# Altium project shield_can-display.PrjPcb
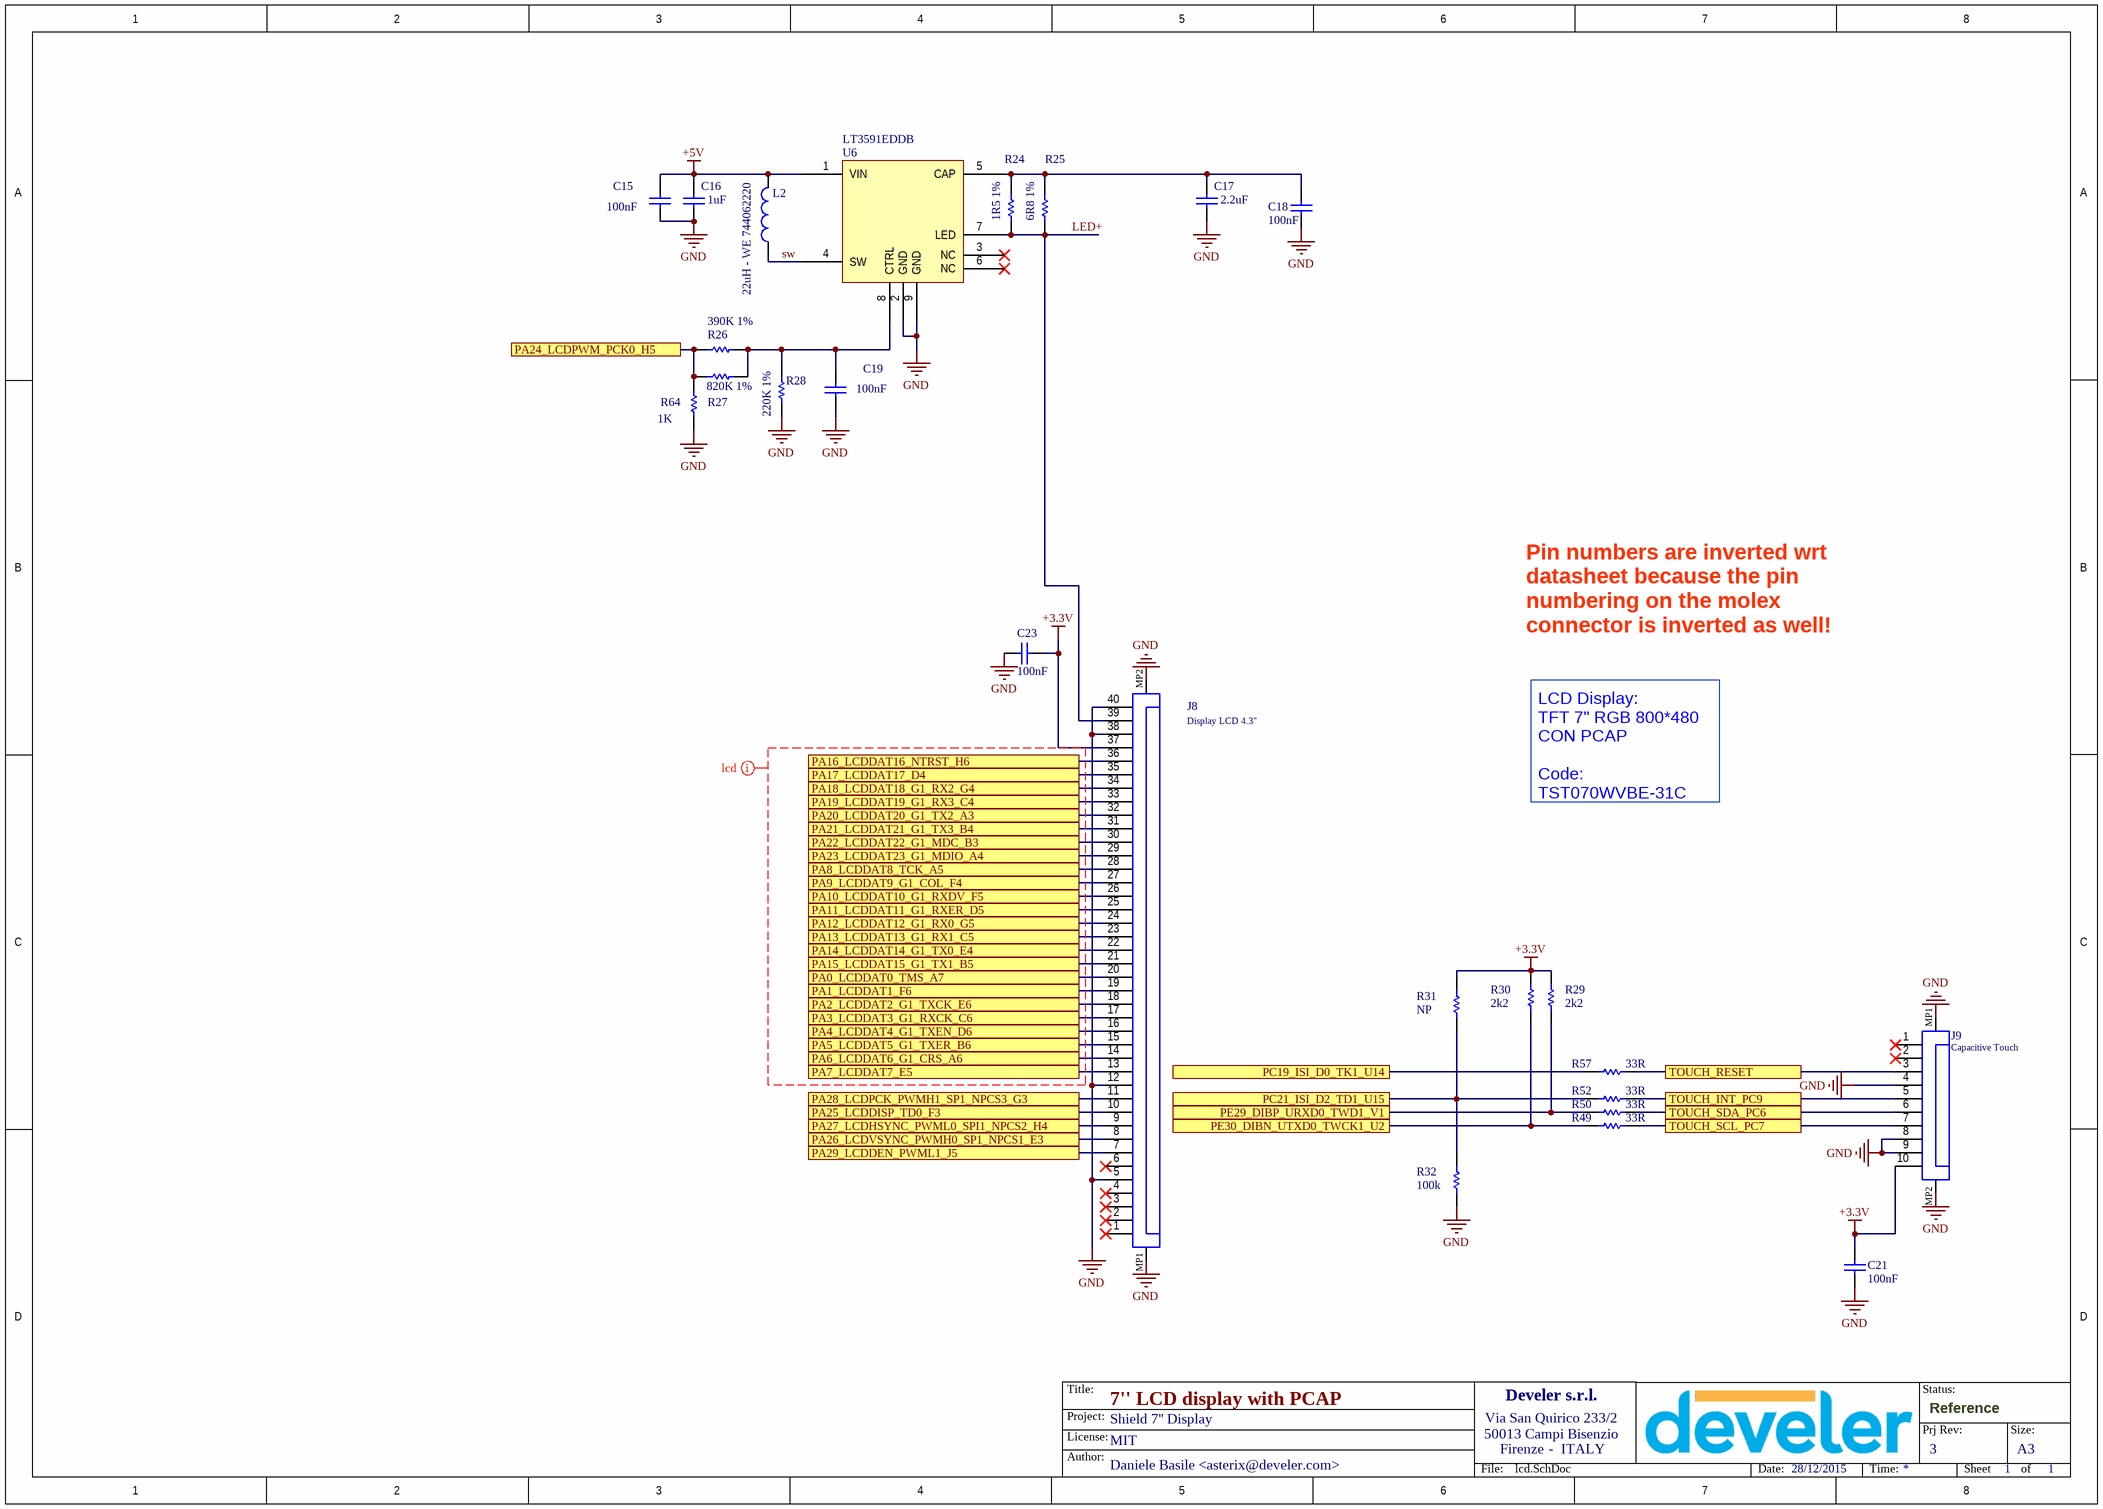
[diagram p0: lcd.SchDoc]
prj_status: Reference; prj_pn: -; prj_pcb: E; prj_name_long: Shield 7'' Display CAN, RS232, RS485; prj_name: Shield 7'' Display; prj_license: MIT; prj_hw_ver: 3; prj_date: 28/12/2015; pcb_stackup: Default; pcb_solder_color: WHITE; pcb_silkscreen_color: BLACK; pcb_material: FR4-Standard Tg 130-140C; pcb_layer_count: 2; pcb_finish: HASL
3 sheets, 96 parts. Net scope: flat (ports and power ports of the same name join across sheets).
Board file: shield_can-display.PcbDoc
Sheets:
  lcd.SchDoc
  eva01_connectors.SchDoc
  can.SchDoc

## Sheet lcd.SchDoc: 7'' LCD display with PCAP
size A3; Author: Daniele Basile <asterix@develer.com>; Organization: Develer s.r.l.; Address1: Via San Quirico 233/2; Address2: 50013 Campi Bisenzio; Address3: Firenze; Address4: ITALY; Revision: A; SheetNumber: 1; SheetTotal: 1; Hw_rev: R1

### Parts
C15  100nF  [0603_[1608]]
C16  1uF  [0603_[1608]]
C17  2.2uF  [1210_[3225]]
C18  100nF  [0603_[1608]]
C19  100nF  [0603_[1608]]
C21  100nF  [0603_[1608]]
C23  100nF  [0603_[1608]]
J8  Display LCD 4.3''  [FCC-ZIF_40PIN_0.5MM_TOP_LOWPROFILE]
J9  Capacitive Touch  [FCC-ZIF_10PIN_0.5MM_LOW_PROFILE]
L2  22uH - WE 744062220  [WE-TPC-6823-X]
R24  1R5 1%  [0603_[1608]]
R25  6R8 1%  [0603_[1608]]
R26  390K 1%  [0603_[1608]]
R27  820K 1%  [0603_[1608]]
R28  220K 1%  [0603_[1608]]
R29  2k2  [0603_[1608]]
R30  2k2  [0603_[1608]]
R31  NP  [0603_[1608]]
R32  100k  [0603_[1608]]
R49  33R  [0603_[1608]]
R50  33R  [0603_[1608]]
R52  33R  [0603_[1608]]
R57  33R  [0603_[1608]]
R64  1K  [0603_[1608]]
U6  LT3591EDDB  [PQFN50P300X200X75_HS-9L]

### Ports
PA0_LCDDAT0_TMS_A7, PA1_LCDDAT1_F6, PA2_LCDDAT2_G1_TXCK_E6, PA3_LCDDAT3_G1_RXCK_C6, PA4_LCDDAT4_G1_TXEN_D6, PA5_LCDDAT5_G1_TXER_B6, PA6_LCDDAT6_G1_CRS_A6, PA7_LCDDAT7_E5, PA8_LCDDAT8_TCK_A5, PA9_LCDDAT9_G1_COL_F4, PA10_LCDDAT10_G1_RXDV_F5, PA11_LCDDAT11_G1_RXER_D5, PA12_LCDDAT12_G1_RX0_G5, PA13_LCDDAT13_G1_RX1_C5, PA14_LCDDAT14_G1_TX0_E4, PA15_LCDDAT15_G1_TX1_B5, PA16_LCDDAT16_NTRST_H6, PA17_LCDDAT17_D4, PA18_LCDDAT18_G1_RX2_G4, PA19_LCDDAT19_G1_RX3_C4, PA20_LCDDAT20_G1_TX2_A3, PA21_LCDDAT21_G1_TX3_B4, PA22_LCDDAT22_G1_MDC_B3, PA23_LCDDAT23_G1_MDIO_A4, PA24_LCDPWM_PCK0_H5, PA25_LCDDISP_TD0_F3, PA26_LCDVSYNC_PWMH0_SP1_NPCS1_E3, PA27_LCDHSYNC_PWML0_SPI1_NPCS2_H4, PA28_LCDPCK_PWMH1_SP1_NPCS3_G3, PA29_LCDDEN_PWML1_J5, PC19_ISI_D0_TK1_U14, PC21_ISI_D2_TD1_U15, PE29_DIBP_URXD0_TWD1_V1, PE30_DIBN_UTXD0_TWCK1_U2, TOUCH_INT_PC9, TOUCH_RESET, TOUCH_SCL_PC7, TOUCH_SDA_PC6

### Nets
+3.3V: C21.1 C23.1 J8.37 J9.10 R29.1 R30.1 R31.1
+5V: C15.2 C16.2 L2.2 U6.1(VIN)
GND: C15.1 C16.1 C17.1 C18.1 C19.1 C21.2 C23.2 J8.5 J8.12 J8.38 J8.40 J8.MP1 J8.MP2 J9.4 J9.8 J9.9 J9.MP1 J9.MP2 R28.2 R32.2 R64.2 U6.2(GND) U6.9(GND)
LED+: J8.39 R24.1 R25.1 U6.7(LED)
PA0_LCDDAT0_TMS_A7: J8.20 ; port PA0_LCDDAT0_TMS_A7
PA1_LCDDAT1_F6: J8.19 ; port PA1_LCDDAT1_F6
PA2_LCDDAT2_G1_TXCK_E6: J8.18 ; port PA2_LCDDAT2_G1_TXCK_E6
PA3_LCDDAT3_G1_RXCK_C6: J8.17 ; port PA3_LCDDAT3_G1_RXCK_C6
PA4_LCDDAT4_G1_TXEN_D6: J8.16 ; port PA4_LCDDAT4_G1_TXEN_D6
PA5_LCDDAT5_G1_TXER_B6: J8.15 ; port PA5_LCDDAT5_G1_TXER_B6
PA6_LCDDAT6_G1_CRS_A6: J8.14 ; port PA6_LCDDAT6_G1_CRS_A6
PA7_LCDDAT7_E5: J8.13 ; port PA7_LCDDAT7_E5
PA8_LCDDAT8_TCK_A5: J8.28 ; port PA8_LCDDAT8_TCK_A5
PA9_LCDDAT9_G1_COL_F4: J8.27 ; port PA9_LCDDAT9_G1_COL_F4
PA10_LCDDAT10_G1_RXDV_F5: J8.26 ; port PA10_LCDDAT10_G1_RXDV_F5
PA11_LCDDAT11_G1_RXER_D5: J8.25 ; port PA11_LCDDAT11_G1_RXER_D5
PA12_LCDDAT12_G1_RX0_G5: J8.24 ; port PA12_LCDDAT12_G1_RX0_G5
PA13_LCDDAT13_G1_RX1_C5: J8.23 ; port PA13_LCDDAT13_G1_RX1_C5
PA14_LCDDAT14_G1_TX0_E4: J8.22 ; port PA14_LCDDAT14_G1_TX0_E4
PA15_LCDDAT15_G1_TX1_B5: J8.21 ; port PA15_LCDDAT15_G1_TX1_B5
PA16_LCDDAT16_NTRST_H6: J8.36 ; port PA16_LCDDAT16_NTRST_H6
PA17_LCDDAT17_D4: J8.35 ; port PA17_LCDDAT17_D4
PA18_LCDDAT18_G1_RX2_G4: J8.34 ; port PA18_LCDDAT18_G1_RX2_G4
PA19_LCDDAT19_G1_RX3_C4: J8.33 ; port PA19_LCDDAT19_G1_RX3_C4
PA20_LCDDAT20_G1_TX2_A3: J8.32 ; port PA20_LCDDAT20_G1_TX2_A3
PA21_LCDDAT21_G1_TX3_B4: J8.31 ; port PA21_LCDDAT21_G1_TX3_B4
PA22_LCDDAT22_G1_MDC_B3: J8.30 ; port PA22_LCDDAT22_G1_MDC_B3
PA23_LCDDAT23_G1_MDIO_A4: J8.29 ; port PA23_LCDDAT23_G1_MDIO_A4
PA24_LCDPWM_PCK0_H5: R26.2 R27.1 R64.1 ; port PA24_LCDPWM_PCK0_H5
PA25_LCDDISP_TD0_F3: J8.10 ; port PA25_LCDDISP_TD0_F3
PA26_LCDVSYNC_PWMH0_SP1_NPCS1_E3: J8.8 ; port PA26_LCDVSYNC_PWMH0_SP1_NPCS1_E3
PA27_LCDHSYNC_PWML0_SPI1_NPCS2_H4: J8.9 ; port PA27_LCDHSYNC_PWML0_SPI1_NPCS2_H4
PA28_LCDPCK_PWMH1_SP1_NPCS3_G3: J8.11 ; port PA28_LCDPCK_PWMH1_SP1_NPCS3_G3
PA29_LCDDEN_PWML1_J5: J8.7 ; port PA29_LCDDEN_PWML1_J5
PC19_ISI_D0_TK1_U14: R57.2 ; port PC19_ISI_D0_TK1_U14
PC21_ISI_D2_TD1_U15: R31.2 R32.1 R52.2 ; port PC21_ISI_D2_TD1_U15
PE29_DIBP_URXD0_TWD1_V1: R29.2 R50.2 ; port PE29_DIBP_URXD0_TWD1_V1
PE30_DIBN_UTXD0_TWCK1_U2: R30.2 R49.2 ; port PE30_DIBN_UTXD0_TWCK1_U2
sw: L2.1 U6.4(SW)
TOUCH_INT_PC9: J9.5 R52.1 ; port TOUCH_INT_PC9
TOUCH_RESET: J9.3 R57.1 ; port TOUCH_RESET
TOUCH_SCL_PC7: J9.7 R49.1 ; port TOUCH_SCL_PC7
TOUCH_SDA_PC6: J9.6 R50.1 ; port TOUCH_SDA_PC6
NetC17_2: C17.2 C18.2 R24.2 R25.2 U6.5(CAP)
NetC19_2: C19.2 R26.1 R27.2 R28.1 U6.8(CTRL)

Not connected (* = marked no-connect by the designer): J8 1* 2* 3* 4* 6*; J9 1* 2*; U6 3(NC)* 6(NC)*

### Layout directives
net class lcd: (no net found under the mark)

### Notes on the sheet
- Pin numbers are inverted wrt datasheet because the pin numbering on the molex connector is inverted as well!
- LCD Display:
  TFT 7" RGB 800*480 CON PCAP
  Code: TST070WVBE-31C
- Title:
- Status:
- Author:
- License:
- Project:
- -
- Prj Rev:
- Size:
- A3
- File:
- Date:
- Time:
- Sheet
- of

### Library data of the parts
C15 C18 C19 C21 C23 = Cap: Ceramic X7R 50V; Value: 10nF; Published: 8-Jun-2000; Revision: July-2002: Re-released for DXP Platform.; Publisher: Altium Limited
C16 = Cap: Ceramic X7R, X5R 16V; Value: 10nF; Published: 8-Jun-2000; Revision: July-2002: Re-released for DXP Platform.; Publisher: Altium Limited
C17 = Cap: Ceramic X7R, X5R 50V; Value: 10nF; Published: 8-Jun-2000; Revision: July-2002: Re-released for DXP Platform.; Publisher: Altium Limited
J8 = FPC-ZIF_40PIN_1MM: Connectors, FPC, SMT ZIF, Low Profile, Horizontal, Top Contact, pitch 0.5 mm, 40 pins (WE 687140183622); Rated Current: 0.4 A; Contact Resistance: 30 mOhm; Withstanding Voltage: 250 VAC; Working Voltage: 50 VAC; Pin Number: 40; Pitch: 0.5 mm; ComponentLink1Description: Manufacturer; ComponentLink1URL: http://www.we-online.de; ComponentLink2Description: Datasheet; ComponentLink2URL: https://katalog.we-online.de/em/datasheet/687140183622.pdf; Part Number: 687140183622; Published Date: August 2018; Publisher: Wurth Elektronik; Operating Temperature: -25 to 85 degC; Packaging: Tape and Reel; Mounting Technology: SMT; Orientation: Horizontal; Contact Design: Top Contact
J9 = FPC-ZIF_10PIN_0.5MM: SMT ZIF Connectors Low Profile WR-FPC, Horizontal, BOT Contact, pitch 0.5 mm, 10 pins; Part Number: 687110183722; Rated Current: 0.4 A; Contact Resistance: 30 mOhm; Withstanding Voltage: 250 VAC; Working Voltage: 50 VAC; Pin Number: 10; Pitch: 0.5 mm; Contact Design: Bottom Contact; ComponentLink1Description: Manufacturer; ComponentLink1URL: http://www.we-online.de; ComponentLink2Description: Datasheet; ComponentLink2URL: https://katalog.we-online.de/em/datasheet/687110183722.pdf; Published Date: August 2018; Publisher: Wurth Elektronik; Operating Temperature: -25 to 85 degC; Packaging: Tape and Reel; Mounting Technology: SMT; Orientation: Horizontal
L2 = Inductor: Power Inductor
R24 R25 R29-R32 = Res1: Resistor 0.125W; Value: 1K; Published: 8-Jun-2000; Revision: July-2002: Re-released for DXP Platform.; Publisher: Altium Limited
R26-R28 R49 R50 R52 R57 = Res1: Resistor; Value: 1K; Published: 8-Jun-2000; Revision: July-2002: Re-released for DXP Platform.; Publisher: Altium Limited
R64 = Res1: Resistor; Published: 8-Jun-2000; Revision: July-2002: Re-released for DXP Platform.; Publisher: Altium Limited; Value: 1K
U6 = LT3591: White LED Driver with Integrated Schottky

## Sheet eva01_connectors.SchDoc: DevelBoard EVA Main Connectors
size A3; Author: Daniele Basile <asterix@develer.com>; Organization: Develer s.r.l.; Address1: via Mugellese 1/A; Address2: 50019 Campi Bisenzio; Address3: Firenze; Address4: ITALY; DocumentNumber: 1; Revision: A; SheetNumber: 1; SheetTotal: 3; Hw_rev: R1
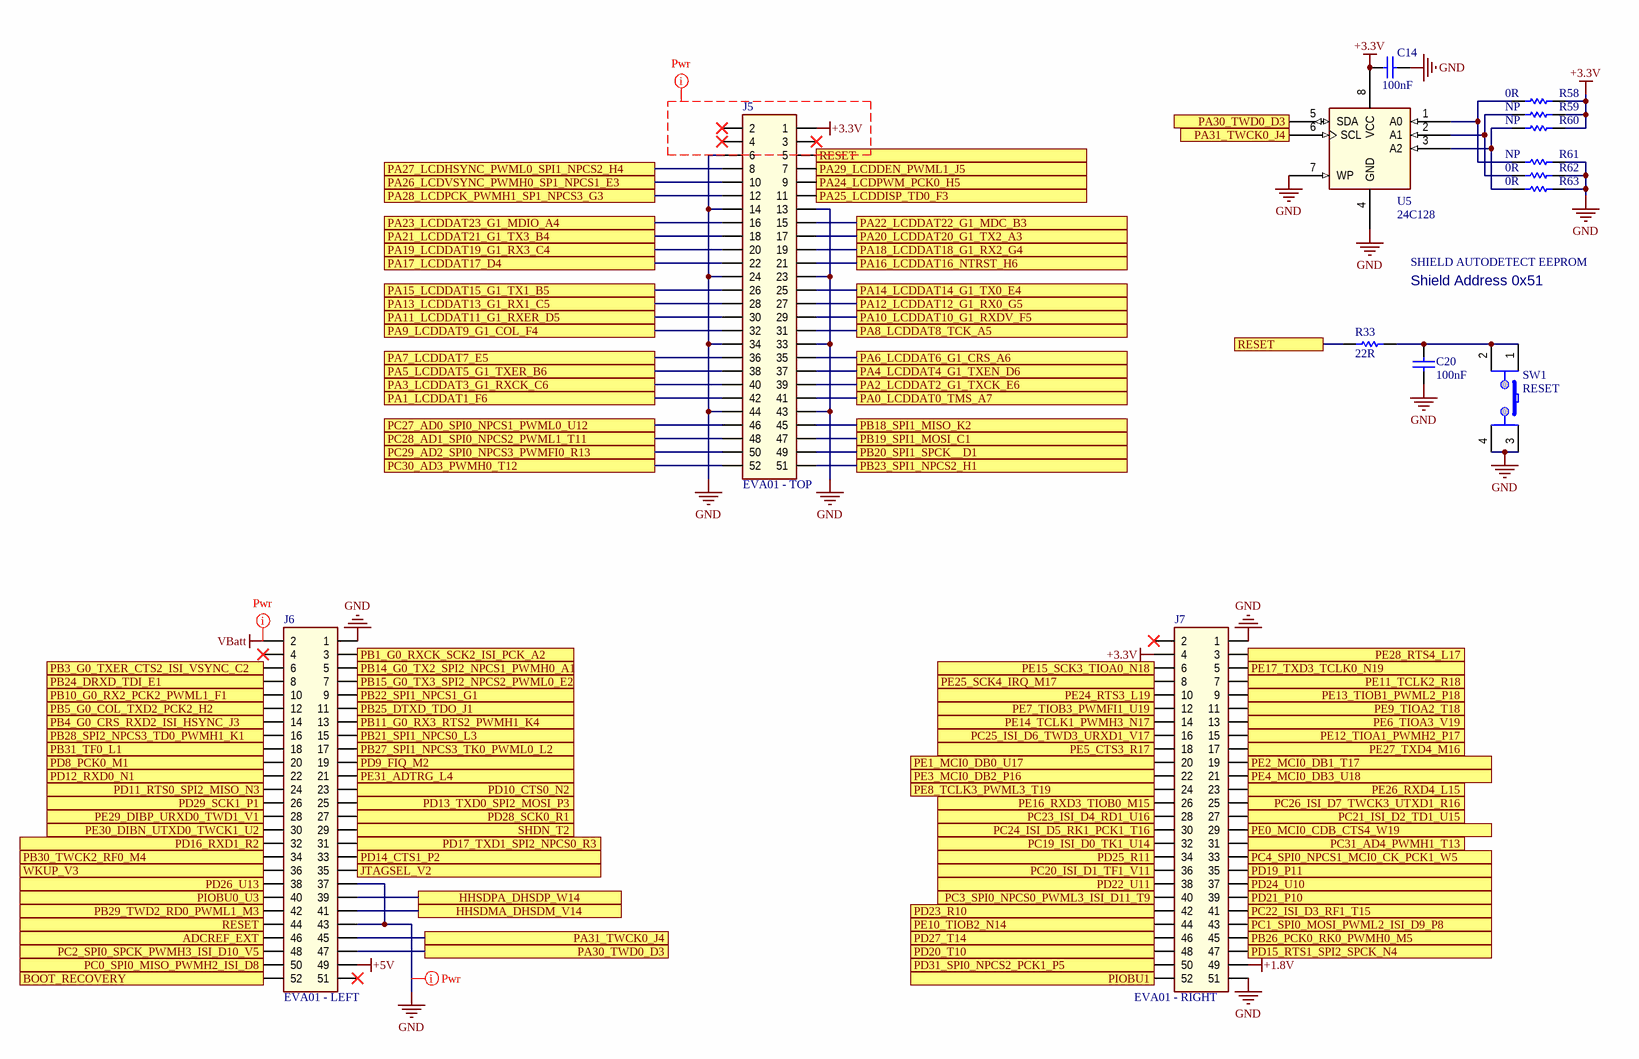
[diagram p1: eva01_connectors.SchDoc]

### Parts
C14  100nF  [0603_[1608]]
C20  100nF  [0603_[1608]]
J5  EVA01 - TOP  [SOCKET_2x26_2.54MM_THD]
J6  EVA01 - LEFT  [SOCKET_2x26_2.54MM_THD]
J7  EVA01 - RIGHT  [SOCKET_2x26_2.54MM_THD]
R33  22R  [0603_[1608]]
R58  0R  [0603_[1608]]
R59  NP  [0603_[1608]]
R60  NP  [0603_[1608]]
R61  NP  [0603_[1608]]
R62  0R  [0603_[1608]]
R63  0R  [0603_[1608]]
SW1  RESET  [TACTILE_SWITCH_6x6MM_SMD]
U5  24C128  [SOIC8]

### Ports
ADCREF_EXT, BOOT_RECOVERY, HHSDMA_DHSDM_V14, HHSDPA_DHSDP_W14, JTAGSEL_V2, PA0_LCDDAT0_TMS_A7, PA1_LCDDAT1_F6, PA2_LCDDAT2_G1_TXCK_E6, PA3_LCDDAT3_G1_RXCK_C6, PA4_LCDDAT4_G1_TXEN_D6, PA5_LCDDAT5_G1_TXER_B6, PA6_LCDDAT6_G1_CRS_A6, PA7_LCDDAT7_E5, PA8_LCDDAT8_TCK_A5, PA9_LCDDAT9_G1_COL_F4, PA10_LCDDAT10_G1_RXDV_F5, PA11_LCDDAT11_G1_RXER_D5, PA12_LCDDAT12_G1_RX0_G5, PA13_LCDDAT13_G1_RX1_C5, PA14_LCDDAT14_G1_TX0_E4, PA15_LCDDAT15_G1_TX1_B5, PA16_LCDDAT16_NTRST_H6, PA17_LCDDAT17_D4, PA18_LCDDAT18_G1_RX2_G4, PA19_LCDDAT19_G1_RX3_C4, PA20_LCDDAT20_G1_TX2_A3, PA21_LCDDAT21_G1_TX3_B4, PA22_LCDDAT22_G1_MDC_B3, PA23_LCDDAT23_G1_MDIO_A4, PA24_LCDPWM_PCK0_H5, PA25_LCDDISP_TD0_F3, PA26_LCDVSYNC_PWMH0_SP1_NPCS1_E3, PA27_LCDHSYNC_PWML0_SPI1_NPCS2_H4, PA28_LCDPCK_PWMH1_SP1_NPCS3_G3, PA29_LCDDEN_PWML1_J5, PA30_TWD0_D3, PA31_TWCK0_J4, PB1_G0_RXCK_SCK2_ISI_PCK_A2, PB3_G0_TXER_CTS2_ISI_VSYNC_C2, PB4_G0_CRS_RXD2_ISI_HSYNC_J3, PB5_G0_COL_TXD2_PCK2_H2, PB10_G0_RX2_PCK2_PWML1_F1, PB11_G0_RX3_RTS2_PWMH1_K4, PB14_G0_TX2_SPI2_NPCS1_PWMH0_A1, PB15_G0_TX3_SPI2_NPCS2_PWML0_E2, PB18_SPI1_MISO_K2, PB19_SPI1_MOSI_C1, PB20_SPI1_SPCK__D1, PB21_SPI1_NPCS0_L3, PB22_SPI1_NPCS1_G1, PB23_SPI1_NPCS2_H1, PB24_DRXD_TDI_E1, PB25_DTXD_TDO_J1, PB26_PCK0_RK0_PWMH0_M5, PB27_SPI1_NPCS3_TK0_PWML0_L2, PB28_SPI2_NPCS3_TD0_PWMH1_K1, PB29_TWD2_RD0_PWML1_M3, PB30_TWCK2_RF0_M4, PB31_TF0_L1, PC0_SPI0_MISO_PWMH2_ISI_D8, PC1_SPI0_MOSI_PWML2_ISI_D9_P8, PC2_SPI0_SPCK_PWMH3_ISI_D10_V5, PC3_SPI0_NPCS0_PWML3_ISI_D11_T9, PC4_SPI0_NPCS1_MCI0_CK_PCK1_W5, PC19_ISI_D0_TK1_U14, PC20_ISI_D1_TF1_V11, PC21_ISI_D2_TD1_U15, PC22_ISI_D3_RF1_T15, PC23_ISI_D4_RD1_U16, PC24_ISI_D5_RK1_PCK1_T16, PC25_ISI_D6_TWD3_URXD1_V17, PC26_ISI_D7_TWCK3_UTXD1_R16, PC27_AD0_SPI0_NPCS1_PWML0_U12, PC28_AD1_SPI0_NPCS2_PWML1_T11, PC29_AD2_SPI0_NPCS3_PWMFI0_R13, PC30_AD3_PWMH0_T12, PC31_AD4_PWMH1_T13, PD8_PCK0_M1, PD9_FIQ_M2, PD10_CTS0_N2, PD11_RTS0_SPI2_MISO_N3, PD12_RXD0_N1, PD13_TXD0_SPI2_MOSI_P3, PD14_CTS1_P2, PD15_RTS1_SPI2_SPCK_N4, PD16_RXD1_R2, PD17_TXD1_SPI2_NPCS0_R3, PD19_P11, PD20_T10, PD21_P10, PD22_U11, PD23_R10, PD24_U10, PD25_R11, PD26_U13, PD27_T14, PD28_SCK0_R1, PD29_SCK1_P1, PD31_SPI0_NPCS2_PCK1_P5, PE0_MCI0_CDB_CTS4_W19, PE1_MCI0_DB0_U17, PE2_MCI0_DB1_T17, PE3_MCI0_DB2_P16, PE4_MCI0_DB3_U18, PE5_CTS3_R17, PE6_TIOA3_V19, PE7_TIOB3_PWMFI1_U19, PE8_TCLK3_PWML3_T19, PE9_TIOA2_T18, PE10_TIOB2_N14, PE11_TCLK2_R18, PE12_TIOA1_PWMH2_P17, PE13_TIOB1_PWML2_P18, PE14_TCLK1_PWMH3_N17, PE15_SCK3_TIOA0_N18, PE16_RXD3_TIOB0_M15, PE17_TXD3_TCLK0_N19, PE24_RTS3_L19, PE25_SCK4_IRQ_M17, PE26_RXD4_L15, PE27_TXD4_M16, PE28_RTS4_L17, PE29_DIBP_URXD0_TWD1_V1, PE30_DIBN_UTXD0_TWCK1_U2, PE31_ADTRG_L4, PIOBU0_U3, PIOBU1, RESET, SHDN_T2, WKUP_V3

### Nets
+1.8V: J7.49
+3.3V: C14.2 J5.1 J7.4 R58.1 R59.1 R60.1 U5.8(VCC)
+5V: J6.49
GND: C14.1 C20.1 J5.6 J5.13 J5.14 J5.23 J5.24 J5.33 J5.34 J5.43 J5.44 J6.1 J6.37 J6.43 J7.1 J7.51 R61.1 R62.1 R63.1 SW1.3 SW1.4 U5.4(GND) U5.7(WP)
VBatt: J6.2
ADCREF_EXT: J6.46 ; port ADCREF_EXT
BOOT_RECOVERY: J6.52 ; port BOOT_RECOVERY
HHSDMA_DHSDM_V14: J6.41 ; port HHSDMA_DHSDM_V14
HHSDPA_DHSDP_W14: J6.39 ; port HHSDPA_DHSDP_W14
JTAGSEL_V2: J6.35 ; port JTAGSEL_V2
PA0_LCDDAT0_TMS_A7: J5.41 ; port PA0_LCDDAT0_TMS_A7
PA1_LCDDAT1_F6: J5.42 ; port PA1_LCDDAT1_F6
PA2_LCDDAT2_G1_TXCK_E6: J5.39 ; port PA2_LCDDAT2_G1_TXCK_E6
PA3_LCDDAT3_G1_RXCK_C6: J5.40 ; port PA3_LCDDAT3_G1_RXCK_C6
PA4_LCDDAT4_G1_TXEN_D6: J5.37 ; port PA4_LCDDAT4_G1_TXEN_D6
PA5_LCDDAT5_G1_TXER_B6: J5.38 ; port PA5_LCDDAT5_G1_TXER_B6
PA6_LCDDAT6_G1_CRS_A6: J5.35 ; port PA6_LCDDAT6_G1_CRS_A6
PA7_LCDDAT7_E5: J5.36 ; port PA7_LCDDAT7_E5
PA8_LCDDAT8_TCK_A5: J5.31 ; port PA8_LCDDAT8_TCK_A5
PA9_LCDDAT9_G1_COL_F4: J5.32 ; port PA9_LCDDAT9_G1_COL_F4
PA10_LCDDAT10_G1_RXDV_F5: J5.29 ; port PA10_LCDDAT10_G1_RXDV_F5
PA11_LCDDAT11_G1_RXER_D5: J5.30 ; port PA11_LCDDAT11_G1_RXER_D5
PA12_LCDDAT12_G1_RX0_G5: J5.27 ; port PA12_LCDDAT12_G1_RX0_G5
PA13_LCDDAT13_G1_RX1_C5: J5.28 ; port PA13_LCDDAT13_G1_RX1_C5
PA14_LCDDAT14_G1_TX0_E4: J5.25 ; port PA14_LCDDAT14_G1_TX0_E4
PA15_LCDDAT15_G1_TX1_B5: J5.26 ; port PA15_LCDDAT15_G1_TX1_B5
PA16_LCDDAT16_NTRST_H6: J5.21 ; port PA16_LCDDAT16_NTRST_H6
PA17_LCDDAT17_D4: J5.22 ; port PA17_LCDDAT17_D4
PA18_LCDDAT18_G1_RX2_G4: J5.19 ; port PA18_LCDDAT18_G1_RX2_G4
PA19_LCDDAT19_G1_RX3_C4: J5.20 ; port PA19_LCDDAT19_G1_RX3_C4
PA20_LCDDAT20_G1_TX2_A3: J5.17 ; port PA20_LCDDAT20_G1_TX2_A3
PA21_LCDDAT21_G1_TX3_B4: J5.18 ; port PA21_LCDDAT21_G1_TX3_B4
PA22_LCDDAT22_G1_MDC_B3: J5.15 ; port PA22_LCDDAT22_G1_MDC_B3
PA23_LCDDAT23_G1_MDIO_A4: J5.16 ; port PA23_LCDDAT23_G1_MDIO_A4
PA24_LCDPWM_PCK0_H5: J5.9 ; port PA24_LCDPWM_PCK0_H5
PA25_LCDDISP_TD0_F3: J5.11 ; port PA25_LCDDISP_TD0_F3
PA26_LCDVSYNC_PWMH0_SP1_NPCS1_E3: J5.10 ; port PA26_LCDVSYNC_PWMH0_SP1_NPCS1_E3
PA27_LCDHSYNC_PWML0_SPI1_NPCS2_H4: J5.8 ; port PA27_LCDHSYNC_PWML0_SPI1_NPCS2_H4
PA28_LCDPCK_PWMH1_SP1_NPCS3_G3: J5.12 ; port PA28_LCDPCK_PWMH1_SP1_NPCS3_G3
PA29_LCDDEN_PWML1_J5: J5.7 ; port PA29_LCDDEN_PWML1_J5
PA30_TWD0_D3: J6.47 U5.5(SDA) ; port PA30_TWD0_D3
PA31_TWCK0_J4: J6.45 U5.6(SCL) ; port PA31_TWCK0_J4
PB1_G0_RXCK_SCK2_ISI_PCK_A2: J6.3 ; port PB1_G0_RXCK_SCK2_ISI_PCK_A2
PB3_G0_TXER_CTS2_ISI_VSYNC_C2: J6.6 ; port PB3_G0_TXER_CTS2_ISI_VSYNC_C2
PB4_G0_CRS_RXD2_ISI_HSYNC_J3: J6.14 ; port PB4_G0_CRS_RXD2_ISI_HSYNC_J3
PB5_G0_COL_TXD2_PCK2_H2: J6.12 ; port PB5_G0_COL_TXD2_PCK2_H2
PB10_G0_RX2_PCK2_PWML1_F1: J6.10 ; port PB10_G0_RX2_PCK2_PWML1_F1
PB11_G0_RX3_RTS2_PWMH1_K4: J6.13 ; port PB11_G0_RX3_RTS2_PWMH1_K4
PB14_G0_TX2_SPI2_NPCS1_PWMH0_A1: J6.5 ; port PB14_G0_TX2_SPI2_NPCS1_PWMH0_A1
PB15_G0_TX3_SPI2_NPCS2_PWML0_E2: J6.7 ; port PB15_G0_TX3_SPI2_NPCS2_PWML0_E2
PB18_SPI1_MISO_K2: J5.45 ; port PB18_SPI1_MISO_K2
PB19_SPI1_MOSI_C1: J5.47 ; port PB19_SPI1_MOSI_C1
PB20_SPI1_SPCK__D1: J5.49 ; port PB20_SPI1_SPCK__D1
PB21_SPI1_NPCS0_L3: J6.15 ; port PB21_SPI1_NPCS0_L3
PB22_SPI1_NPCS1_G1: J6.9 ; port PB22_SPI1_NPCS1_G1
PB23_SPI1_NPCS2_H1: J5.51 ; port PB23_SPI1_NPCS2_H1
PB24_DRXD_TDI_E1: J6.8 ; port PB24_DRXD_TDI_E1
PB25_DTXD_TDO_J1: J6.11 ; port PB25_DTXD_TDO_J1
PB26_PCK0_RK0_PWMH0_M5: J7.45 ; port PB26_PCK0_RK0_PWMH0_M5
PB27_SPI1_NPCS3_TK0_PWML0_L2: J6.17 ; port PB27_SPI1_NPCS3_TK0_PWML0_L2
PB28_SPI2_NPCS3_TD0_PWMH1_K1: J6.16 ; port PB28_SPI2_NPCS3_TD0_PWMH1_K1
PB29_TWD2_RD0_PWML1_M3: J6.42 ; port PB29_TWD2_RD0_PWML1_M3
PB30_TWCK2_RF0_M4: J6.34 ; port PB30_TWCK2_RF0_M4
PB31_TF0_L1: J6.18 ; port PB31_TF0_L1
PC0_SPI0_MISO_PWMH2_ISI_D8: J6.50 ; port PC0_SPI0_MISO_PWMH2_ISI_D8
PC1_SPI0_MOSI_PWML2_ISI_D9_P8: J7.43 ; port PC1_SPI0_MOSI_PWML2_ISI_D9_P8
PC2_SPI0_SPCK_PWMH3_ISI_D10_V5: J6.48 ; port PC2_SPI0_SPCK_PWMH3_ISI_D10_V5
PC3_SPI0_NPCS0_PWML3_ISI_D11_T9: J7.40 ; port PC3_SPI0_NPCS0_PWML3_ISI_D11_T9
PC4_SPI0_NPCS1_MCI0_CK_PCK1_W5: J7.33 ; port PC4_SPI0_NPCS1_MCI0_CK_PCK1_W5
PC19_ISI_D0_TK1_U14: J7.32 ; port PC19_ISI_D0_TK1_U14
PC20_ISI_D1_TF1_V11: J7.36 ; port PC20_ISI_D1_TF1_V11
PC21_ISI_D2_TD1_U15: J7.27 ; port PC21_ISI_D2_TD1_U15
PC22_ISI_D3_RF1_T15: J7.41 ; port PC22_ISI_D3_RF1_T15
PC23_ISI_D4_RD1_U16: J7.28 ; port PC23_ISI_D4_RD1_U16
PC24_ISI_D5_RK1_PCK1_T16: J7.30 ; port PC24_ISI_D5_RK1_PCK1_T16
PC25_ISI_D6_TWD3_URXD1_V17: J7.16 ; port PC25_ISI_D6_TWD3_URXD1_V17
PC26_ISI_D7_TWCK3_UTXD1_R16: J7.25 ; port PC26_ISI_D7_TWCK3_UTXD1_R16
PC27_AD0_SPI0_NPCS1_PWML0_U12: J5.46 ; port PC27_AD0_SPI0_NPCS1_PWML0_U12
PC28_AD1_SPI0_NPCS2_PWML1_T11: J5.48 ; port PC28_AD1_SPI0_NPCS2_PWML1_T11
PC29_AD2_SPI0_NPCS3_PWMFI0_R13: J5.50 ; port PC29_AD2_SPI0_NPCS3_PWMFI0_R13
PC30_AD3_PWMH0_T12: J5.52 ; port PC30_AD3_PWMH0_T12
PC31_AD4_PWMH1_T13: J7.31 ; port PC31_AD4_PWMH1_T13
PD8_PCK0_M1: J6.20 ; port PD8_PCK0_M1
PD9_FIQ_M2: J6.19 ; port PD9_FIQ_M2
PD10_CTS0_N2: J6.23 ; port PD10_CTS0_N2
PD11_RTS0_SPI2_MISO_N3: J6.24 ; port PD11_RTS0_SPI2_MISO_N3
PD12_RXD0_N1: J6.22 ; port PD12_RXD0_N1
PD13_TXD0_SPI2_MOSI_P3: J6.25 ; port PD13_TXD0_SPI2_MOSI_P3
PD14_CTS1_P2: J6.33 ; port PD14_CTS1_P2
PD15_RTS1_SPI2_SPCK_N4: J7.47 ; port PD15_RTS1_SPI2_SPCK_N4
PD16_RXD1_R2: J6.32 ; port PD16_RXD1_R2
PD17_TXD1_SPI2_NPCS0_R3: J6.31 ; port PD17_TXD1_SPI2_NPCS0_R3
PD19_P11: J7.35 ; port PD19_P11
PD20_T10: J7.48 ; port PD20_T10
PD21_P10: J7.39 ; port PD21_P10
PD22_U11: J7.38 ; port PD22_U11
PD23_R10: J7.42 ; port PD23_R10
PD24_U10: J7.37 ; port PD24_U10
PD25_R11: J7.34 ; port PD25_R11
PD26_U13: J6.38 ; port PD26_U13
PD27_T14: J7.46 ; port PD27_T14
PD28_SCK0_R1: J6.27 ; port PD28_SCK0_R1
PD29_SCK1_P1: J6.26 ; port PD29_SCK1_P1
PD31_SPI0_NPCS2_PCK1_P5: J7.50 ; port PD31_SPI0_NPCS2_PCK1_P5
PE0_MCI0_CDB_CTS4_W19: J7.29 ; port PE0_MCI0_CDB_CTS4_W19
PE1_MCI0_DB0_U17: J7.20 ; port PE1_MCI0_DB0_U17
PE2_MCI0_DB1_T17: J7.19 ; port PE2_MCI0_DB1_T17
PE3_MCI0_DB2_P16: J7.22 ; port PE3_MCI0_DB2_P16
PE4_MCI0_DB3_U18: J7.21 ; port PE4_MCI0_DB3_U18
PE5_CTS3_R17: J7.18 ; port PE5_CTS3_R17
PE6_TIOA3_V19: J7.13 ; port PE6_TIOA3_V19
PE7_TIOB3_PWMFI1_U19: J7.12 ; port PE7_TIOB3_PWMFI1_U19
PE8_TCLK3_PWML3_T19: J7.24 ; port PE8_TCLK3_PWML3_T19
PE9_TIOA2_T18: J7.11 ; port PE9_TIOA2_T18
PE10_TIOB2_N14: J7.44 ; port PE10_TIOB2_N14
PE11_TCLK2_R18: J7.7 ; port PE11_TCLK2_R18
PE12_TIOA1_PWMH2_P17: J7.15 ; port PE12_TIOA1_PWMH2_P17
PE13_TIOB1_PWML2_P18: J7.9 ; port PE13_TIOB1_PWML2_P18
PE14_TCLK1_PWMH3_N17: J7.14 ; port PE14_TCLK1_PWMH3_N17
PE15_SCK3_TIOA0_N18: J7.6 ; port PE15_SCK3_TIOA0_N18
PE16_RXD3_TIOB0_M15: J7.26 ; port PE16_RXD3_TIOB0_M15
PE17_TXD3_TCLK0_N19: J7.5 ; port PE17_TXD3_TCLK0_N19
PE24_RTS3_L19: J7.10 ; port PE24_RTS3_L19
PE25_SCK4_IRQ_M17: J7.8 ; port PE25_SCK4_IRQ_M17
PE26_RXD4_L15: J7.23 ; port PE26_RXD4_L15
PE27_TXD4_M16: J7.17 ; port PE27_TXD4_M16
PE28_RTS4_L17: J7.3 ; port PE28_RTS4_L17
PE29_DIBP_URXD0_TWD1_V1: J6.28 ; port PE29_DIBP_URXD0_TWD1_V1
PE30_DIBN_UTXD0_TWCK1_U2: J6.30 ; port PE30_DIBN_UTXD0_TWCK1_U2
PE31_ADTRG_L4: J6.21 ; port PE31_ADTRG_L4
PIOBU0_U3: J6.40 ; port PIOBU0_U3
PIOBU1: J7.52 ; port PIOBU1
RESET: J5.5 J6.44 R33.2 ; port RESET
SHDN_T2: J6.29 ; port SHDN_T2
WKUP_V3: J6.36 ; port WKUP_V3
NetC20_2: C20.2 R33.1 SW1.1 SW1.2
NetR58_2: R58.2 R61.2 U5.1(A0)
NetR59_2: R59.2 R62.2 U5.2(A1)
NetR60_2: R60.2 R63.2 U5.3(A2)

Not connected (* = marked no-connect by the designer): J5 2* 3* 4*; J6 4* 51*; J7 2*

### Layout directives
net class Power: +3.3V, GND, VBatt

### Notes on the sheet
- SHIELD AUTODETECT EEPROM
- Shield Address 0x51
- Title:
- Status:
- Author:
- License:
- Project:
- -
- Prj Rev:
- Size:
- A3
- File:
- Date:
- Time:
- Sheet
- of

### Library data of the parts
C14 C20 = Cap: Ceramic X7R 50V; Value: 10nF; Published: 8-Jun-2000; Revision: July-2002: Re-released for DXP Platform.; Publisher: Altium Limited
J5 = Header 26x2: Socket Header, 26 pin, 13x2, 2.54mm, H=8.5mm; Part Number: Tyco 1-1634688; Purchase Code: RS 473-8254
J6 J7 = Header 26x2: Pin header 26x2; Part Number: Tyco 1-1634688; Purchase Code: RS 473-8254
R33 R58-R63 = Res1: Resistor; Value: 1K; Published: 8-Jun-2000; Revision: July-2002: Re-released for DXP Platform.; Publisher: Altium Limited
SW1 = tactile_switch: Tactile switch smd H=4.3mm 10x6mm (like cod. Farnell 2435308)
U5 = EEPROM-SOIC8: EEPROM

## Sheet can.SchDoc: CAN/RS232/RS485
size A3; Author: Francesco Sacchi <batt@develer.com>; Organization: Develer s.r.l.; Address1: via Mugellese 1/A; Address2: 50019 Campi Bisenzio; Address3: Firenze; Address4: ITALY; DocumentNumber: 3; Revision: A; SheetNumber: 3; SheetTotal: 3; Hw_rev: R1
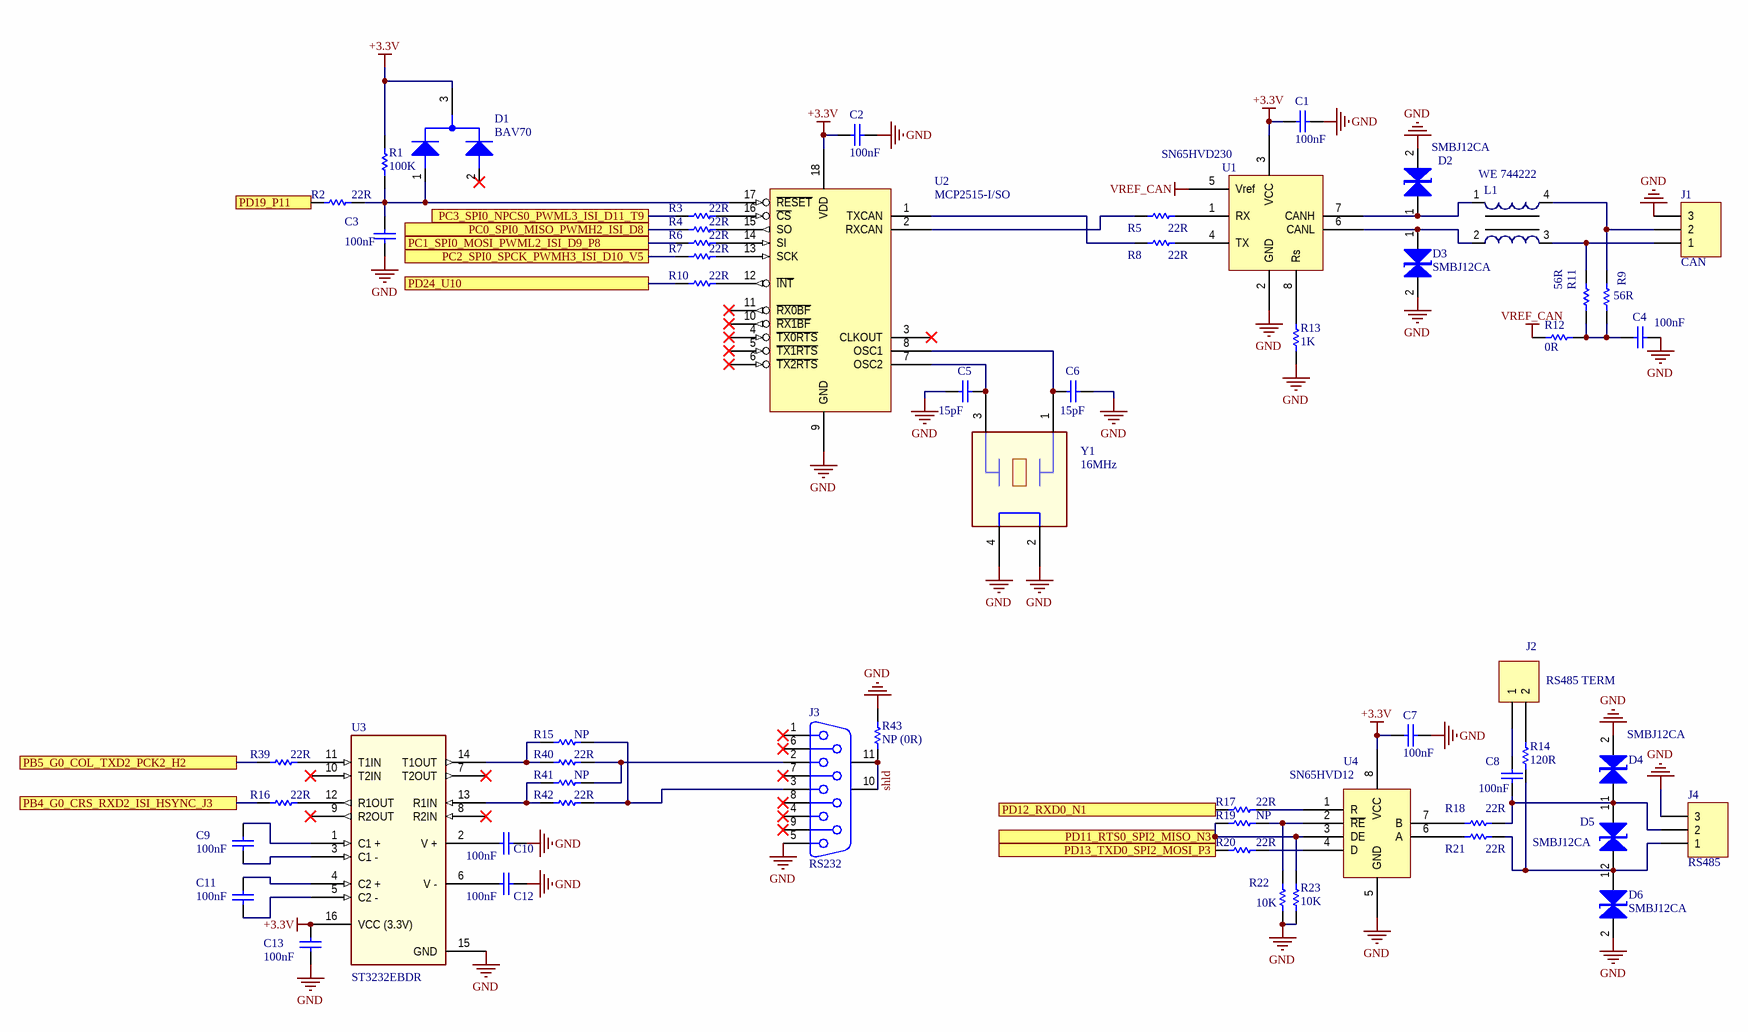
[diagram p2: can.SchDoc]

### Parts
C1  100nF  [0603_[1608]]
C2  100nF  [0603_[1608]]
C3  100nF  [0603_[1608]]
C4  100nF  [0603_[1608]]
C5  15pF  [0603_[1608]]
C6  15pF  [0603_[1608]]
C7  100nF  [0603_[1608]]
C8  100nF  [0603_[1608]]
C9  100nF  [0603_[1608]]
C10  100nF  [0603_[1608]]
C11  100nF  [0603_[1608]]
C12  100nF  [0603_[1608]]
C13  100nF  [0603_[1608]]
D1  BAV70  [SOT-23]
D2  SMBJ12CA  [DO214AA_12]
D3  SMBJ12CA  [DO214AA_12]
D4  SMBJ12CA  [DO214AA_12]
D5  SMBJ12CA  [DO214AA_12]
D6  SMBJ12CA  [DO214AA_12]
J1  CAN  [TBLOCK_1X3_3.5MM_HOR_THD]
J2  RS485 TERM  [HEADER_1X2_2.54MM_THD]
J3  RS232  [DSUB1.385-2H9_FEMALE]
J4  RS485  [TBLOCK_1X3_3.5MM_HOR_THD]
L1  WE 744222  [WE-SL2]
R1  100K  [0603_[1608]]
R2  22R  [0603_[1608]]
R3  22R  [0603_[1608]]
R4  22R  [0603_[1608]]
R5  22R  [0603_[1608]]
R6  22R  [0603_[1608]]
R7  22R  [0603_[1608]]
R8  22R  [0603_[1608]]
R9  56R  [0603_[1608]]
R10  22R  [0603_[1608]]
R11  56R  [0603_[1608]]
R12  0R  [0603_[1608]]
R13  1K  [0603_[1608]]
R14  120R  [0603_[1608]]
R15  NP  [0603_[1608]]
R16  22R  [0603_[1608]]
R17  22R  [0603_[1608]]
R18  22R  [0603_[1608]]
R19  NP  [0603_[1608]]
R20  22R  [0603_[1608]]
R21  22R  [0603_[1608]]
R22  10K  [0603_[1608]]
R23  10K  [0603_[1608]]
R39  22R  [0603_[1608]]
R40  22R  [0603_[1608]]
R41  NP  [0603_[1608]]
R42  22R  [0603_[1608]]
R43  NP (0R)  [0603_[1608]]
U1  SN65HVD230  [SOIC8]
U2  MCP2515-I/SO  [SOIC18]
U3  ST3232EBDR  [SOIC16]
U4  SN65HVD12  [SOIC8]
Y1  16MHz  [CRYSTAL_3.2X2.5MM_4P_SMD]

### Ports
PB4_G0_CRS_RXD2_ISI_HSYNC_J3, PB5_G0_COL_TXD2_PCK2_H2, PC0_SPI0_MISO_PWMH2_ISI_D8, PC1_SPI0_MOSI_PWML2_ISI_D9_P8, PC2_SPI0_SPCK_PWMH3_ISI_D10_V5, PC3_SPI0_NPCS0_PWML3_ISI_D11_T9, PD11_RTS0_SPI2_MISO_N3, PD12_RXD0_N1, PD13_TXD0_SPI2_MOSI_P3, PD19_P11, PD24_U10

### Nets
+3.3V: C1.2 C2.2 C7.2 C13.2 D1.3 R1.1 U1.3(VCC) U2.18(VDD) U3.16(VCC_(3.3V)) U4.8(VCC)
GND: C1.1 C2.1 C3.2 C4.1 C5.2 C6.1 C7.1 C10.1 C12.1 C13.1 D2.2 D3.2 D4.2 D6.2 J1.3 J3.5 J4.3 R13.1 R22.1 R23.1 R43.1 U1.2(GND) U2.9(GND) U3.15(GND) U4.5(GND) Y1.2 Y1.4
VREF_CAN: R12.1 U1.5(Vref)
PB4_G0_CRS_RXD2_ISI_HSYNC_J3: R16.1 ; port PB4_G0_CRS_RXD2_ISI_HSYNC_J3
PB5_G0_COL_TXD2_PCK2_H2: R39.1 ; port PB5_G0_COL_TXD2_PCK2_H2
PC0_SPI0_MISO_PWMH2_ISI_D8: R4.1 ; port PC0_SPI0_MISO_PWMH2_ISI_D8
PC1_SPI0_MOSI_PWML2_ISI_D9_P8: R6.1 ; port PC1_SPI0_MOSI_PWML2_ISI_D9_P8
PC2_SPI0_SPCK_PWMH3_ISI_D10_V5: R7.1 ; port PC2_SPI0_SPCK_PWMH3_ISI_D10_V5
PC3_SPI0_NPCS0_PWML3_ISI_D11_T9: R3.1 ; port PC3_SPI0_NPCS0_PWML3_ISI_D11_T9
PD11_RTS0_SPI2_MISO_N3: R19.2 R23.2 U4.3(DE) ; port PD11_RTS0_SPI2_MISO_N3
PD12_RXD0_N1: R17.2 ; port PD12_RXD0_N1
PD13_TXD0_SPI2_MOSI_P3: R20.2 ; port PD13_TXD0_SPI2_MOSI_P3
PD19_P11: R2.2 ; port PD19_P11
PD24_U10: R10.1 ; port PD24_U10
shld: J3.10(MH1) J3.11(MH2) R43.2
NetC3_1: C3.1 D1.1 R1.2 R2.1 U2.17(~{RESET})
NetC4_2: C4.2 R9.2 R11.2 R12.2
NetC5_1: C5.1 U2.7(OSC2) Y1.3
NetC6_2: C6.2 U2.8(OSC1) Y1.1
NetC8_1: C8.1 J2.1
NetC8_2: C8.2 D4.1 D5.1 J4.2 R18.2
NetC9_1: C9.1 U3.1(C1_+)
NetC9_2: C9.2 U3.3(C1_-)
NetC10_2: C10.2 U3.2(V_+)
NetC11_1: C11.1 U3.5(C2_-)
NetC11_2: C11.2 U3.4(C2_+)
NetC12_2: C12.2 U3.6(V_-)
NetD2_1: D2.1 L1.1 U1.7(CANH)
NetD3_1: D3.1 L1.2 U1.6(CANL)
NetD5_2: D5.2 D6.1 J4.1 R14.2 R21.2
NetJ1_1: J1.1 L1.3 R11.1
NetJ1_2: J1.2 L1.4 R9.1
NetJ2_2: J2.2 R14.1
NetJ3_2: J3.2 R40.2 R41.2
NetJ3_3: J3.3 R15.2 R42.2
NetR3_2: R3.2 U2.16(~{CS})
NetR4_2: R4.2 U2.15(SO)
NetR5_1: R5.1 U2.2(RXCAN)
NetR5_2: R5.2 U1.1(RX)
NetR6_2: R6.2 U2.14(SI)
NetR7_2: R7.2 U2.13(SCK)
NetR8_1: R8.1 U2.1(TXCAN)
NetR8_2: R8.2 U1.4(TX)
NetR10_2: R10.2 U2.12(~{INT})
NetR13_2: R13.2 U1.8(Rs)
NetR15_1: R15.1 R40.1 U3.14(T1OUT)
NetR16_2: R16.2 U3.12(R1OUT)
NetR17_1: R17.1 U4.1(R)
NetR18_1: R18.1 U4.7(B)
NetR19_1: R19.1 R22.2 U4.2(~{RE})
NetR20_1: R20.1 U4.4(D)
NetR21_1: R21.1 U4.6(A)
NetR39_2: R39.2 U3.11(T1IN)
NetR41_1: R41.1 R42.1 U3.13(R1IN)

Not connected (* = marked no-connect by the designer): D1 2*; J3 1* 4* 6* 7* 8* 9*; U2 3(CLKOUT)* 4(~{TX0RTS})* 5(~{TX1RTS})* 6(~{TX2RTS})* 10(~{RX1BF})* 11(~{RX0BF})*; U3 7(T2OUT)* 8(R2IN)* 9(R2OUT)* 10(T2IN)*

### Notes on the sheet
- Title:
- Status:
- Author:
- License:
- Project:
- -
- Prj Rev:
- Size:
- A3
- File:
- Date:
- Time:
- Sheet
- of

### Library data of the parts
C1-C4 C7-C13 = Cap: Ceramic X7R 50V; Value: 100pF; Published: 8-Jun-2000; LatestRevisionDate: 17-Jul-2002; LatestRevisionNote: Re-released for DXP Platform.; PackageReference: RAD-0.3; Publisher: Altium Limited; PackageDescription: Radial Cap, Thru-Hole; 2 Leads; 0.3 in Pin Spacing
C5 C6 = Cap: Ceramic 50V NP0/C0G; Value: 100pF; Published: 8-Jun-2000; LatestRevisionDate: 17-Jul-2002; LatestRevisionNote: Re-released for DXP Platform.; PackageReference: RAD-0.3; Publisher: Altium Limited; PackageDescription: Radial Cap, Thru-Hole; 2 Leads; 0.3 in Pin Spacing
D1 = BAV70: Diode
D2-D6 = TVS bi: TVS bidirectional
J1 J4 = Header 3: Terminal block Header 3.5mm Horizontal (WE 691322110003); LatestRevisionDate: 17-Jul-2002; LatestRevisionNote: Re-released for DXP Platform.; Publisher: Altium Limited
J2 = Header 2: Pin Header, 2.54mm, 1x2, 2pin; LatestRevisionDate: 17-Jul-2002; LatestRevisionNote: Re-released for DXP Platform.; Publisher: Altium Limited
J3 = D Connector 9: Receptacle Assembly, 9 Position, Right Angle (WE 618009231421); PackageDocument: O; Positions: 9; Published: 15-Jun-2001; LatestRevisionDate: 17-Jul-2002; LatestRevisionNote: Re-released for DXP Platform.; DatasheetDocument: 1-Sep-1999; PackageReference: 788750; Publisher: Altium Limited; Orientation: Right Angle; Gender: Receptacle
L1 = WE-CMB XS, 744821240: Common Mode line Filter; Manufacturer: Würth Elektronik eiSos GmbH; Inductance: 4.00 mH; partNo: 744821240; ComponentLink1Description: Manufacturer; ComponentLink1URL: http://www.we-online.de; Created by: Christin Zierenner; Created Date: March 2010; ComponentLink2Description: Datasheet; ComponentLink2URL: http://www.we-online.de/katalog/media/pdf/744821240.pdf
R1 R3-R16 R18 R19 R21-R23 R39-R42 = Res1: Resistor; Revision: July-2002: Re-released for DXP Platform.
R2 R17 R20 R43 = Res1: Resistor; Value: 1K; Published: 8-Jun-2000; Revision: July-2002: Re-released for DXP Platform.; Publisher: Altium Limited
U1 = SN65HVD230: 3.3V CAN bus transceiver (SN65HVD231; SN65HVD232)
U2 = MCP2515: Stand-Alone CAN controller with SPI interface
U3 = ST3232CDR: 3 to 5.5 V, low power, up to 400 kbps RS-232 driver; Part Number: STm ST3232CDR; Purchase Code: Digikey 497-3731-6-ND
U4 = SN65HVD12: 3.3V to RS485 interface
Y1 = CRYSTAL-4p: Crystal

## Nets that join several sheets
+3.3V: lcd (7 pins), eva01_connectors (7 pins), can (10 pins)
+5V: lcd (C15.2 C16.2 L2.2 U6.1), eva01_connectors (J6.49)
GND: lcd (23 pins), eva01_connectors (23 pins), can (27 pins)
PA0_LCDDAT0_TMS_A7: lcd (J8.20), eva01_connectors (J5.41)
PA1_LCDDAT1_F6: lcd (J8.19), eva01_connectors (J5.42)
PA2_LCDDAT2_G1_TXCK_E6: lcd (J8.18), eva01_connectors (J5.39)
PA3_LCDDAT3_G1_RXCK_C6: lcd (J8.17), eva01_connectors (J5.40)
PA4_LCDDAT4_G1_TXEN_D6: lcd (J8.16), eva01_connectors (J5.37)
PA5_LCDDAT5_G1_TXER_B6: lcd (J8.15), eva01_connectors (J5.38)
PA6_LCDDAT6_G1_CRS_A6: lcd (J8.14), eva01_connectors (J5.35)
PA7_LCDDAT7_E5: lcd (J8.13), eva01_connectors (J5.36)
PA8_LCDDAT8_TCK_A5: lcd (J8.28), eva01_connectors (J5.31)
PA9_LCDDAT9_G1_COL_F4: lcd (J8.27), eva01_connectors (J5.32)
PA10_LCDDAT10_G1_RXDV_F5: lcd (J8.26), eva01_connectors (J5.29)
PA11_LCDDAT11_G1_RXER_D5: lcd (J8.25), eva01_connectors (J5.30)
PA12_LCDDAT12_G1_RX0_G5: lcd (J8.24), eva01_connectors (J5.27)
PA13_LCDDAT13_G1_RX1_C5: lcd (J8.23), eva01_connectors (J5.28)
PA14_LCDDAT14_G1_TX0_E4: lcd (J8.22), eva01_connectors (J5.25)
PA15_LCDDAT15_G1_TX1_B5: lcd (J8.21), eva01_connectors (J5.26)
PA16_LCDDAT16_NTRST_H6: lcd (J8.36), eva01_connectors (J5.21)
PA17_LCDDAT17_D4: lcd (J8.35), eva01_connectors (J5.22)
PA18_LCDDAT18_G1_RX2_G4: lcd (J8.34), eva01_connectors (J5.19)
PA19_LCDDAT19_G1_RX3_C4: lcd (J8.33), eva01_connectors (J5.20)
PA20_LCDDAT20_G1_TX2_A3: lcd (J8.32), eva01_connectors (J5.17)
PA21_LCDDAT21_G1_TX3_B4: lcd (J8.31), eva01_connectors (J5.18)
PA22_LCDDAT22_G1_MDC_B3: lcd (J8.30), eva01_connectors (J5.15)
PA23_LCDDAT23_G1_MDIO_A4: lcd (J8.29), eva01_connectors (J5.16)
PA24_LCDPWM_PCK0_H5: lcd (R26.2 R27.1 R64.1), eva01_connectors (J5.9)
PA25_LCDDISP_TD0_F3: lcd (J8.10), eva01_connectors (J5.11)
PA26_LCDVSYNC_PWMH0_SP1_NPCS1_E3: lcd (J8.8), eva01_connectors (J5.10)
PA27_LCDHSYNC_PWML0_SPI1_NPCS2_H4: lcd (J8.9), eva01_connectors (J5.8)
PA28_LCDPCK_PWMH1_SP1_NPCS3_G3: lcd (J8.11), eva01_connectors (J5.12)
PA29_LCDDEN_PWML1_J5: lcd (J8.7), eva01_connectors (J5.7)
PB4_G0_CRS_RXD2_ISI_HSYNC_J3: eva01_connectors (J6.14), can (R16.1)
PB5_G0_COL_TXD2_PCK2_H2: eva01_connectors (J6.12), can (R39.1)
PC0_SPI0_MISO_PWMH2_ISI_D8: eva01_connectors (J6.50), can (R4.1)
PC1_SPI0_MOSI_PWML2_ISI_D9_P8: eva01_connectors (J7.43), can (R6.1)
PC2_SPI0_SPCK_PWMH3_ISI_D10_V5: eva01_connectors (J6.48), can (R7.1)
PC3_SPI0_NPCS0_PWML3_ISI_D11_T9: eva01_connectors (J7.40), can (R3.1)
PC19_ISI_D0_TK1_U14: lcd (R57.2), eva01_connectors (J7.32)
PC21_ISI_D2_TD1_U15: lcd (R31.2 R32.1 R52.2), eva01_connectors (J7.27)
PD11_RTS0_SPI2_MISO_N3: eva01_connectors (J6.24), can (R19.2 R23.2 U4.3)
PD12_RXD0_N1: eva01_connectors (J6.22), can (R17.2)
PD13_TXD0_SPI2_MOSI_P3: eva01_connectors (J6.25), can (R20.2)
PD19_P11: eva01_connectors (J7.35), can (R2.2)
PD24_U10: eva01_connectors (J7.37), can (R10.1)
PE29_DIBP_URXD0_TWD1_V1: lcd (R29.2 R50.2), eva01_connectors (J6.28)
PE30_DIBN_UTXD0_TWCK1_U2: lcd (R30.2 R49.2), eva01_connectors (J6.30)